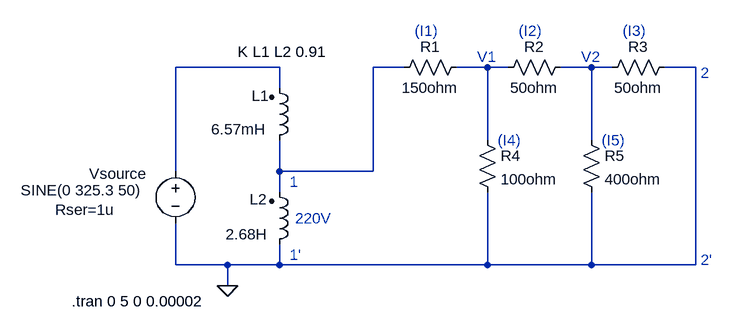
[diagram p0: schematic circuit1.asc]
circuit1.asc, the LTspice schematic file:
Version 4
SHEET 1 1092 680
WIRE 256 16 96 16
WIRE 448 16 400 16
WIRE 576 16 528 16
WIRE 608 16 576 16
WIRE 736 16 688 16
WIRE 768 16 736 16
WIRE 896 16 848 16
WIRE 256 48 256 16
WIRE 576 128 576 16
WIRE 736 128 736 16
WIRE 96 176 96 16
WIRE 256 176 256 128
WIRE 400 176 400 16
WIRE 400 176 256 176
WIRE 256 208 256 176
WIRE 96 320 96 256
WIRE 176 320 96 320
WIRE 256 320 256 288
WIRE 256 320 176 320
WIRE 576 320 576 208
WIRE 576 320 256 320
WIRE 736 320 736 208
WIRE 736 320 576 320
WIRE 896 320 896 16
WIRE 896 320 736 320
WIRE 176 352 176 320
FLAG 176 352 0
SYMBOL voltage 96 160 R0
WINDOW 0 -133 20 Left 2
WINDOW 3 -238 45 Left 2
WINDOW 123 0 0 Left 0
WINDOW 39 -185 75 Left 2
SYMATTR InstName Vsource
SYMATTR Value SINE(0 325.3 50)
SYMATTR SpiceLine Rser=1u
SYMBOL ind2 240 144 M180
WINDOW 0 -27 84 Left 2
WINDOW 3 -89 33 Left 2
SYMATTR InstName L1
SYMATTR Value 6.57mH
SYMATTR Type ind
SYMBOL ind2 240 304 M180
WINDOW 0 -30 85 Left 2
WINDOW 3 -67 31 Left 2
SYMATTR InstName L2
SYMATTR Value 2.68H
SYMATTR Type ind
SYMBOL res 544 0 R90
WINDOW 0 0 56 VBottom 2
WINDOW 3 32 56 VTop 2
SYMATTR InstName R1
SYMATTR Value 150ohm
SYMBOL res 704 0 R90
WINDOW 0 0 56 VBottom 2
WINDOW 3 32 56 VTop 2
SYMATTR InstName R2
SYMATTR Value 50ohm
SYMBOL res 864 0 R90
WINDOW 0 0 56 VBottom 2
WINDOW 3 32 56 VTop 2
SYMATTR InstName R3
SYMATTR Value 50ohm
SYMBOL res 560 112 R0
SYMATTR InstName R4
SYMATTR Value 100ohm
SYMBOL res 720 112 R0
SYMATTR InstName R5
SYMATTR Value 400ohm
TEXT 192 -8 Left 2 !K L1 L2 0.91
TEXT -64 376 Left 2 !.tran 0 5 0 0.00002
TEXT 272 304 Left 2 ;1'
TEXT 272 192 Left 2 ;1
TEXT 904 24 Left 2 ;2
TEXT 904 312 Left 2 ;2'
TEXT 280 248 Left 2 ;220V
TEXT 560 0 Left 2 ;V1
TEXT 720 0 Left 2 ;V2
TEXT 464 -40 Left 2 ;(I1)
TEXT 624 -40 Left 2 ;(I2)
TEXT 784 -40 Left 2 ;(I3)
TEXT 592 128 Left 2 ;(I4)
TEXT 752 128 Left 2 ;(I5)

The netlist it stands for:
* circuit1.asc
Vsource N001 0 SINE(0 325.3 50) Rser=1u
L1 N002 N001 6.57mH
L2 0 N002 2.68H
R1 N003 N002 150ohm
R2 N004 N003 50ohm
R3 0 N004 50ohm
R4 N003 0 100ohm
R5 N004 0 400ohm
K L1 L2 0.91
.tran 0 5 0 0.00002
* 1'
* 1
* 2
* 2'
* 220V
* V1
* V2
* (I1)
* (I2)
* (I3)
* (I4)
* (I5)
.backanno
.end